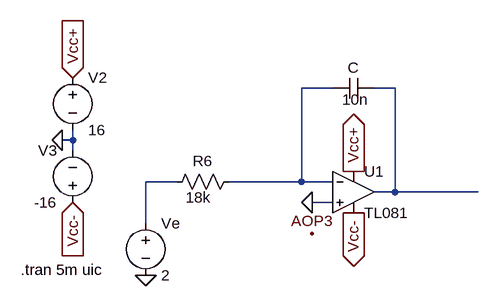
[diagram p0: schematic 3_AOP3.asc]
3_AOP3.asc, the LTspice schematic file:
Version 4
SHEET 1 880 680
WIRE 96 -400 48 -400
WIRE 192 -400 160 -400
WIRE -304 -320 -304 -336
WIRE -304 -320 -320 -320
WIRE -304 -304 -304 -320
WIRE -144 -256 -192 -256
WIRE 48 -256 48 -400
WIRE 48 -256 -64 -256
WIRE 96 -256 48 -256
WIRE 192 -240 192 -400
WIRE 192 -240 160 -240
WIRE 320 -240 192 -240
WIRE 96 -224 64 -224
WIRE -192 -192 -192 -256
FLAG -320 -320 0
FLAG -304 -416 Vcc+
IOPIN -304 -416 In
FLAG -304 -224 Vcc-
IOPIN -304 -224 In
FLAG 128 -272 Vcc+
IOPIN 128 -272 Out
FLAG 128 -208 Vcc-
IOPIN 128 -208 Out
FLAG 64 -224 0
FLAG 64 -176 AOP3
FLAG -192 -112 0
SYMBOL voltage -304 -432 R0
SYMATTR InstName V2
SYMATTR Value 16
SYMBOL voltage -304 -208 R180
WINDOW 0 24 96 Left 2
WINDOW 3 24 16 Left 2
SYMATTR InstName V3
SYMATTR Value -16
SYMBOL res -48 -272 R90
WINDOW 0 0 56 VBottom 2
WINDOW 3 56 63 VBottom 2
SYMATTR InstName R6
SYMATTR Value 18k
SYMBOL cap 96 -384 R270
WINDOW 0 32 32 VTop 2
WINDOW 3 -17 35 VTop 2
SYMATTR InstName C
SYMATTR Value 10n
SYMBOL OpAmps\\TL081 128 -304 R0
SYMATTR InstName U1
SYMBOL voltage -192 -208 R0
WINDOW 123 0 0 Left 0
WINDOW 39 0 0 Left 0
SYMATTR InstName Ve
SYMATTR Value 2
TEXT -384 -120 Left 2 !.tran 5m uic

The netlist it stands for:
* 3_AOP3.asc
V2 Vcc+ 0 16
V3 Vcc- 0 -16
R6 N001 N003 18k
C N001 N002 10n
XU1 0 N001 Vcc+ Vcc- N002 TL081  ; pins In+ In- V+ V- OUT
Ve N003 0 2
.tran 5m uic
.backanno
.end